# EAGLE design md_ver10.5 (EAGLE 6.4)
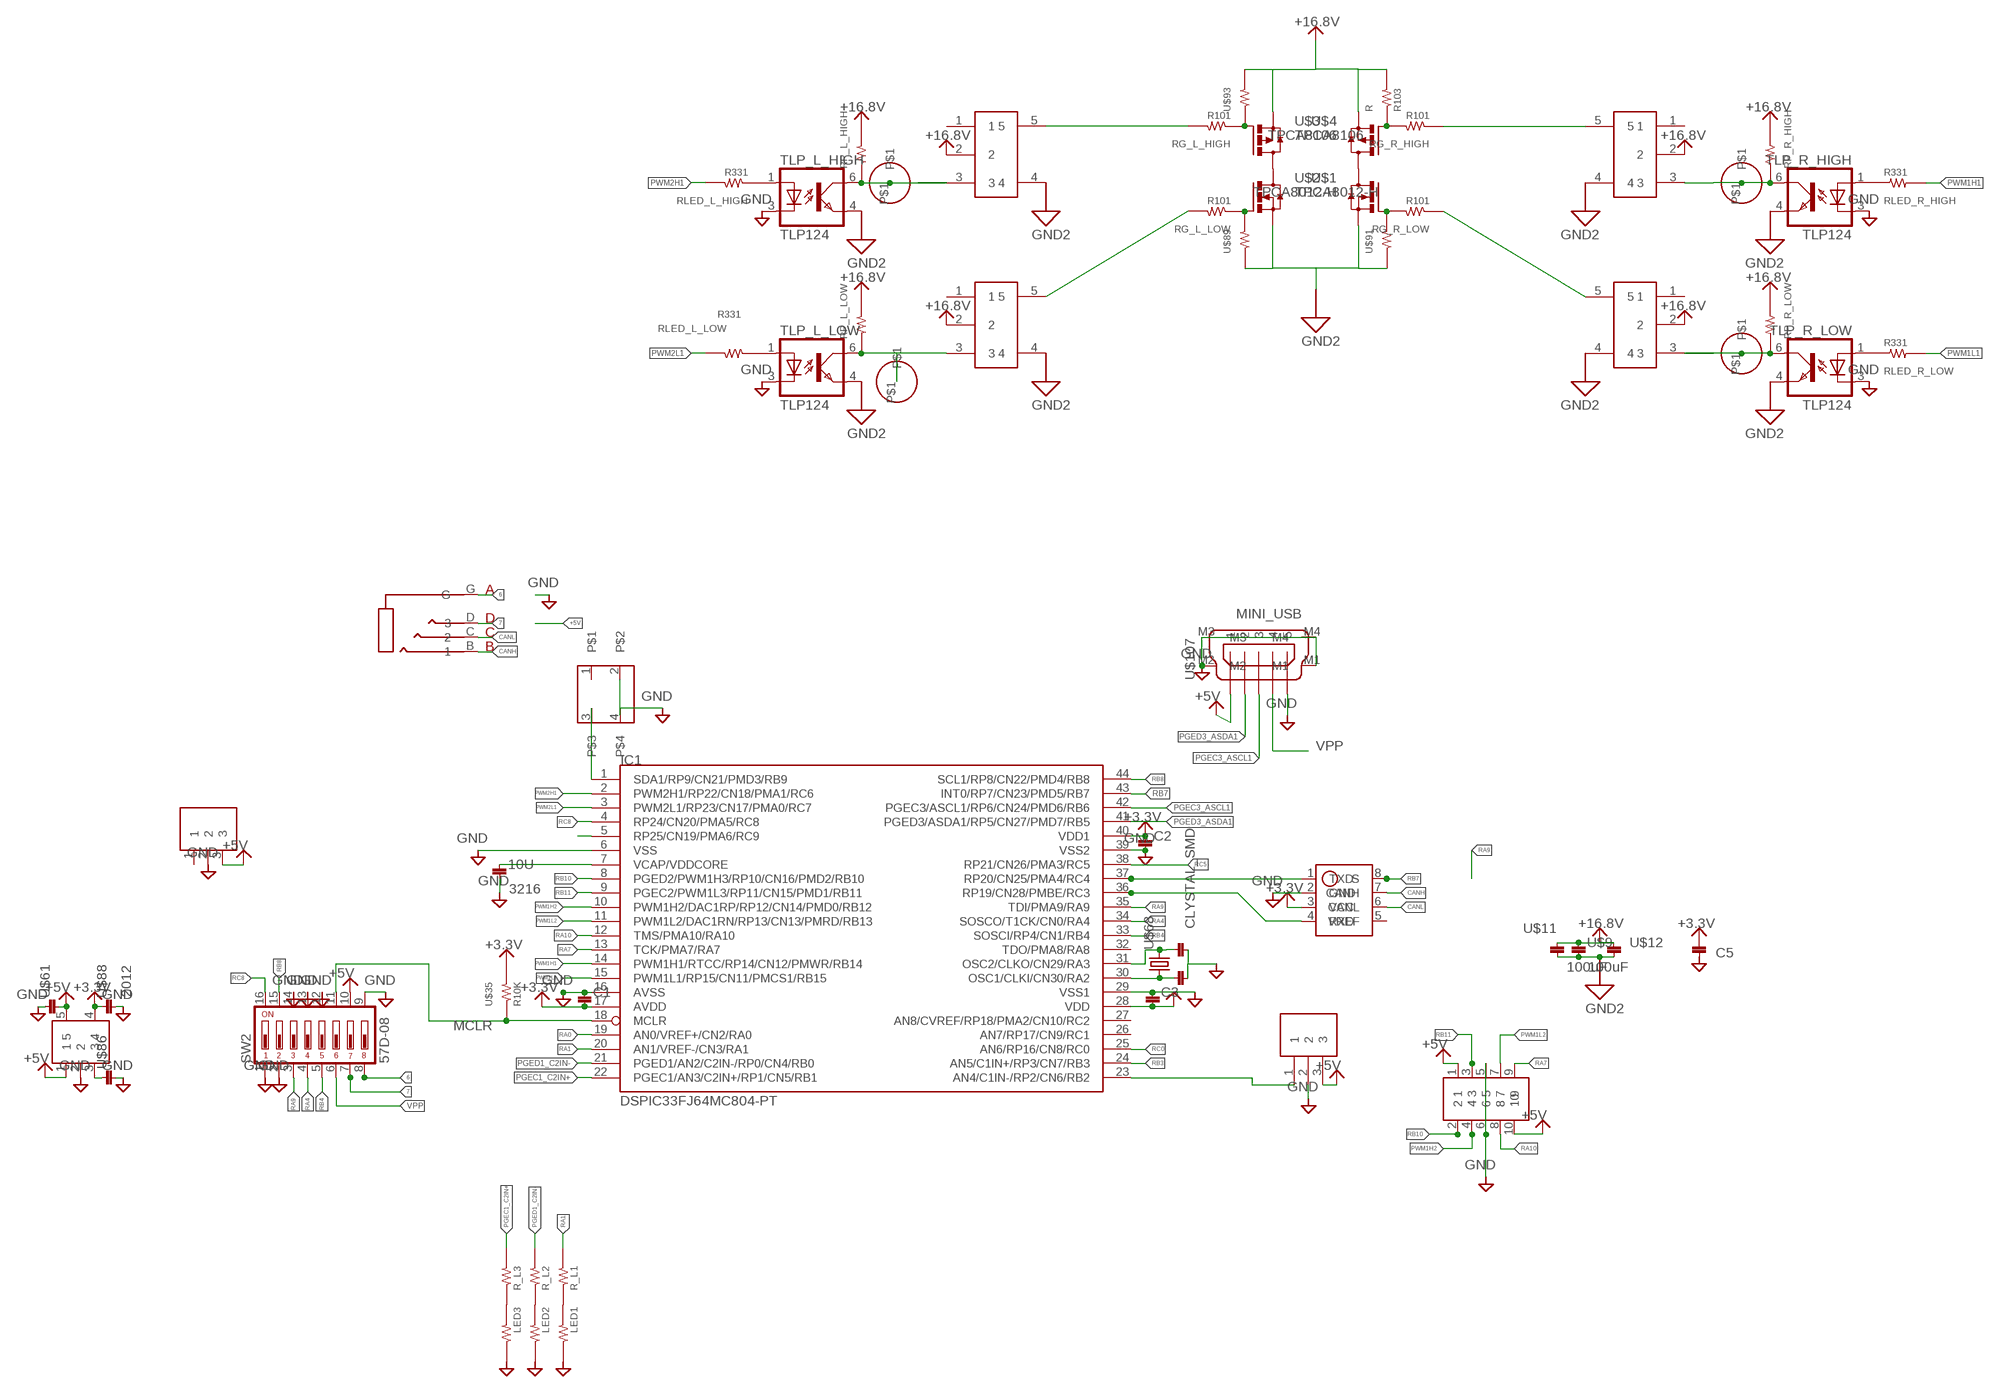
[diagram p0: schematic, sheet 1]

## Parts
10U  3216  [3216]
C  C5  1608  [1608]
C1  1608  [1608]
C2  1608  [1608]
C3  1608  [1608]
IC1  DSPIC33FJ64MC804-PT  [TQFP44]
IC2  TAR5SB  [SSOP5-P-0.95]
IC3  ＰＬ－ＩＲＭ  [ＰＬ－ＩＲＭ]
IC4  SN65HVD1050  [SOIC8]
IC5  Ｒ－７８Ｅ５．０  [Ｒ－７８Ｅ５．０]
IC_L_HIGH  MCP1415  [SOT23-5L]
IC_L_LOW  MCP1415  [SOT23-5L]
IC_R_HIGH  MCP1415  [SOT23-5L]
IC_R_LOW  MCP1415  [SOT23-5L]
R  R103  RESISTOR__SMD  [1608]
RG_L_HIGH  R101  RESISTOR__SMD  [1608]
RG_L_LOW  R101  RESISTOR__SMD  [1608]
RG_R_HIGH  R101  RESISTOR__SMD  [1608]
RG_R_LOW  R101  RESISTOR__SMD  [1608]
RLED_L_HIGH  R331  RESISTOR__SMD  [1608]
RLED_L_LOW  R331  RESISTOR__SMD  [1608]
RLED_R_HIGH  R331  RESISTOR__SMD  [1608]
RLED_R_LOW  R331  RESISTOR__SMD  [1608]
RP_L_HIGH  RESISTOR__SMD  [1608]
RP_L_LOW  RESISTOR__SMD  [1608]
RP_R_HIGH  RESISTOR__SMD  [1608]
RP_R_LOW  RESISTOR__SMD  [1608]
SW1  TACT  [TL1105]
SW2  57D-08  [57D]
TLP_L_HIGH  TLP124  [11−4C1]
TLP_L_LOW  TLP124  [11−4C1]
TLP_R_HIGH  TLP124  [11−4C1]
TLP_R_LOW  TLP124  [11−4C1]
U$1  TPCA8012-H  [2-5Q1A]
U$2  TPCA8012-H  [2-5Q1A]
U$3  TPCA8106  [2-5Q1A]
U$4  TPCA8106  [2-5Q1A]
U$7  20pF  1608  [1608]
U$8  20pF  1608  [1608]
U$9  100uF  3225  [3225]
U$11  100uF  3225  [3225]
U$12  3225  [3225]
U$15  PIN_HEADER_52  [PIN_HEADER_5*2]
U$35  R10K  RESISTOR__SMD  [1608]
U$61  1608  [1608]
U$64  AUDIO4  [AUDIO4_MJ]
U$68  CLYSTAL_SMD  [CRYSTAL_SMD]
U$72  R_L3  RESISTOR__SMD  [1608]
U$74  LED3  RESISTOR__SMD  [1608]
U$75  R_L2  RESISTOR__SMD  [1608]
U$76  LED2  RESISTOR__SMD  [1608]
U$77  R_L1  RESISTOR__SMD  [1608]
U$78  LED1  RESISTOR__SMD  [1608]
U$86  1608  [1608]
U$88  2012  [2012]
U$89  RESISTOR__SMD  [1608]
U$91  RESISTOR__SMD  [1608]
U$93  RESISTOR__SMD  [1608]
U$103  PAD1_4MM  [PAD1_4MM]
U$104  PAD1_4MM  [PAD1_4MM]
U$105  PAD1_4MM  [PAD1_4MM]
U$106  PAD1_4MM  [PAD1_4MM]
U$107  MINI_USB  [MINI_USB]

## Nets
6: SW2.8 U$64.G
7: SW2.7 U$64.D
+3.3V: C1.P$2 C2.P$1 C3.P$2 C.P$1 IC1.17(AVDD) IC1.28(VDD) IC1.40(VDD1) IC2.4 IC4.3(VCC) U$35.2 U$88.1
+5V: IC2.1 IC2.5 IC3.3 IC5.3 SW2.10 U$15.1 U$15.10 U$61.P$2 U$107.1
+16.8V: IC_L_HIGH.2 IC_L_LOW.2 IC_R_HIGH.2 IC_R_LOW.2 R.2 RP_L_HIGH.2 RP_L_LOW.2 RP_R_HIGH.2 RP_R_LOW.2 U$3.1(S) U$3.2(S) U$3.3(S) U$4.1(S) U$4.2(S) U$4.3(S) U$9.P$1 U$11.P$1 U$12.P$1 U$93.2
CANH: IC4.7(CANH) U$64.B
CANL: IC4.6(CANL) U$64.C
GND: 10U.P$2 C1.P$1 C2.P$2 C3.P$1 C.P$2 IC1.6(VSS) IC1.16(AVSS) IC1.29(VSS1) IC1.39(VSS2) IC2.2 IC3.2 IC4.2(GND) IC5.2 SW1.2 SW1.4 SW2.1 SW2.2 SW2.9 SW2.12 SW2.13 SW2.14 TLP_L_HIGH.3(C) TLP_L_LOW.3(C) TLP_R_HIGH.3(C) TLP_R_LOW.3(C) U$7.P$2 U$8.P$2 U$15.5 U$15.6 U$61.P$1 U$74.1 U$76.1 U$78.1 U$86.P$2 U$88.2 U$107.5 U$107.M1 U$107.M2 U$107.M3 U$107.M4
GND2: IC_L_HIGH.4 IC_L_LOW.4 IC_R_HIGH.4 IC_R_LOW.4 TLP_L_HIGH.4(EMIT) TLP_L_LOW.4(EMIT) TLP_R_HIGH.4(EMIT) TLP_R_LOW.4(EMIT) U$1.1(S) U$1.2(S) U$1.3(S) U$2.1(S) U$2.2(S) U$2.3(S) U$9.P$2 U$11.P$2 U$12.P$2 U$89.1 U$91.1
M1: U$2.5(D) U$2.6(D) U$2.7(D) U$2.8(D) U$3.5(D) U$3.6(D) U$3.7(D) U$3.8(D)
M2: U$1.5(D) U$1.6(D) U$1.7(D) U$1.8(D) U$4.5(D) U$4.6(D) U$4.7(D) U$4.8(D)
MCLR: IC1.18(MCLR) SW2.11 U$35.1
N$1: RG_L_LOW.1 U$2.4(G) U$89.2
N$2: IC2.3 U$86.P$1
N$3: RLED_L_LOW.1 TLP_L_LOW.1(A)
N$4: RG_R_LOW.2 U$1.4(G) U$91.2
N$5: IC_L_HIGH.5 RG_L_HIGH.2
N$6: IC_L_LOW.3 RP_L_LOW.1 TLP_L_LOW.6(COL) U$104.P$1
N$7: IC_R_LOW.5 RG_R_LOW.1
N$9: RLED_R_LOW.1 TLP_R_LOW.1(A)
N$11: IC_L_HIGH.3 RP_L_HIGH.1 TLP_L_HIGH.6(COL) U$103.P$1
N$12: RLED_L_HIGH.1 TLP_L_HIGH.1(A)
N$14: IC_L_LOW.5 RG_L_LOW.2
N$15: IC_R_HIGH.3 RP_R_HIGH.1 TLP_R_HIGH.6(COL) U$105.P$1
N$16: RLED_R_HIGH.1 TLP_R_HIGH.1(A)
N$17: IC1.23(AN4/C1IN-/RP2/CN6/RB2) IC3.1
N$18: IC_R_HIGH.5 RG_R_HIGH.1
N$19: RG_L_HIGH.1 U$3.4(G) U$93.1
N$20: R.1 RG_R_HIGH.2 U$4.4(G)
N$21: U$72.1 U$74.2
N$22: IC1.30(OSC1/CLKI/CN30/RA2) U$7.P$1 U$68.1
N$23: IC1.31(OSC2/CLKO/CN29/RA3) U$8.P$1 U$68.2
N$24: U$75.1 U$76.2
N$25: U$77.1 U$78.2
N$26: IC1.1(SDA1/RP9/CN21/PMD3/RB9) SW1.3
N$27: IC1.37(RP20/CN25/PMA4/RC4) IC4.1(TXD)
N$28: IC1.5(RP25/CN19/PMA6/RC9)
N$30: IC1.36(RP19/CN28/PMBE/RC3) IC4.4(RXD)
PGEC1_C2IN+: IC1.22(PGEC1/AN3/C2IN+/RP1/CN5/RB1) U$72.2
PGEC3_ASCL1: IC1.42(PGEC3/ASCL1/RP6/CN24/PMD6/RB6) U$107.3
PGED1_C2IN-: IC1.21(PGED1/AN2/C2IN-/RP0/CN4/RB0) U$75.2
PGED3_ASDA1: IC1.41(PGED3/ASDA1/RP5/CN27/PMD7/RB5) U$107.2
PWM1H1: IC1.14(PWM1H1/RTCC/RP14/CN12/PMWR/RB14) RLED_R_HIGH.2
PWM1H2: IC1.10(PWM1H2/DAC1RP/RP12/CN14/PMD0/RB12) U$15.4
PWM1L1: IC1.15(PWM1L1/RP15/CN11/PMCS1/RB15) RLED_R_LOW.2
PWM1L2: IC1.11(PWM1L2/DAC1RN/RP13/CN13/PMRD/RB13) U$15.7
PWM2H1: IC1.2(PWM2H1/RP22/CN18/PMA1/RC6) RLED_L_HIGH.2
PWM2L1: IC1.3(PWM2L1/RP23/CN17/PMA0/RC7) RLED_L_LOW.2
RA0: IC1.19(AN0/VREF+/CN2/RA0)
RA1: IC1.20(AN1/VREF-/CN3/RA1) U$77.2
RA4: IC1.34(SOSCO/T1CK/CN0/RA4) SW2.4
RA7: IC1.13(TCK/PMA7/RA7) U$15.9
RA9: IC1.35(TDI/PMA9/RA9) SW2.3
RA10: IC1.12(TMS/PMA10/RA10) U$15.8
RB3: IC1.24(AN5/C1IN+/RP3/CN7/RB3)
RB4: IC1.33(SOSCI/RP4/CN1/RB4) SW2.5
RB7: IC1.43(INT0/RP7/CN23/PMD5/RB7) IC4.8(S)
RB8: IC1.44(SCL1/RP8/CN22/PMD4/RB8) SW2.15
RB10: IC1.8(PGED2/PWM1H3/RP10/CN16/PMD2/RB10) U$15.2
RB11: IC1.9(PGEC2/PWM1L3/RP11/CN15/PMD1/RB11) U$15.3
RC0: IC1.25(AN6/RP16/CN8/RC0)
RC5: IC1.38(RP21/CN26/PMA3/RC5)
RC8: IC1.4(RP24/CN20/PMA5/RC8) SW2.16
TLP_R_LOW: IC_R_LOW.3 RP_R_LOW.1 TLP_R_LOW.6(COL) U$106.P$1
VCAP/VDDCORE: 10U.P$1 IC1.7(VCAP/VDDCORE)
VPP: SW2.6 U$107.4
Unconnected: IC1.26(AN7/RP17/CN9/RC1) IC1.27(AN8/CVREF/RP18/PMA2/CN10/RC2) IC1.32(TDO/PMA8/RA8) IC4.5(VREF) IC5.1 IC_L_HIGH.1 IC_L_LOW.1 IC_R_HIGH.1 IC_R_LOW.1 SW1.1

## Library data of the parts
10U = 02_C:3216
C C1-C3 U$7 U$8 U$61 U$86 = 02_C:1608
IC1 = microchip-dspic33fjxxmc:DSPIC33FJ64MC804: dsPIC33FJ32MC302/304, dsPIC33FJ64MCX02/X04, AND dsPIC33FJ128MCX02/X04 High-Performance, 16-bit Digital Signal Controllers Package:44 Pin TQFP Operating Range: * Up to 40 MIPS operation (at 3.0V -3.6V): - Industrial temperature range (-40°C to +85°C) - Extended temperature range (-40°C to +125°C) High-Performance DSC CPU: * Modified Harvard architecture * C compiler optimized instruction set * 16-bit wide data path * 24-bit wide instructions * Linear program memory addressing up to 4M instruction words * Linear data memory addressing up to 64 Kbytes * 83 base instructions: mostly 1 word/1 cycle * Two 40-bit accumulators with rounding and saturation options * Flexible and powerful addressing modes: - Indirect - Modulo - Bit-Reversed * Software stack * 16 x 16 fractional/integer multiply operations * 32/16 and 16/16 divide operations * Single-cycle multiply and accumulate: - Accumulator write back for DSP operations - Dual data fetch * Up to ±16-bit shifts for up to 40-bit data Direct Memory Access (DMA): * 8-channel hardware DMA * Up to 2 Kbytes dual ported DMA buffer area (DMA RAM) to store data transferred via DMA: - Allows data transfer between RAM and a peripheral while CPU is executing code (no cycle stealing) * Most peripherals support DMA Timers/Capture/Compare/PWM: * Timer/Counters, up to five 16-bit timers: - Can pair up to make two 32-bit timers - One timer runs as a Real-Time Clock with an external 32.768 kHz oscillator - Programmable prescaler * Input Capture (up to four channels): - Capture on up, down or both edges - 16-bit capture input functions - 4-deep FIFO on each capture * Output Compare (up to four channels): - Single or Dual 16-bit Compare mode - 16-bit Glitchless PWM mode * Hardware Real-Time Clock/Calendar (RTCC): - Provides clock, calendar, and alarm functions Interrupt Controller: * 5-cycle latency * Up to 53 available interrupt sources * Up to three external interrupts * Seven programmable priority levels * Five processor exceptions Digital I/O: * Peripheral pin Select functionality * Up to 35 programmable digital I/O pins * Wake-up/Interrupt-on-Change for up to 31 pins * Output pins can drive from 3.0V to 3.6V * Up to 5V output with open drain configuration * All digital input pins are 5V tolerant * 4 mA sink on all I/O pins On-Chip Flash and SRAM: * Flash program memory (up to 128 Kbytes) * Data SRAM (up to 16 Kbytes) * Boot, Secure, and General Security for program Flash System Management: * Flexible clock options: - External, crystal, resonator, internal RC - Fully integrated Phase-Locked Loop (PLL) - Extremely low jitter PLL * Power-up Timer * Oscillator Start-up Timer/Stabilizer * Watchdog Timer with its own RC oscillator * Fail-Safe Clock Monitor * Reset by multiple sources Power Management: * On-chip 2.5V voltage regulator * Switch between clock sources in real time * Idle, Sleep, and Doze modes with fast wake-up Analog-to-Digital Converters (ADCs): * 10-bit, 1.1 Msps or 12-bit, 500 Ksps conversion: - Two and four simultaneous samples (10-bit ADC) - Up to nine input channels with auto-scanning - Conversion start can be manual or synchronized with one of four trigger sources - Conversion possible in Sleep mode - ±2 LSb max integral nonlinearity - ±1 LSb max differential nonlinearity Audio Digital-to-Analog Converter (DAC): - 16-bit Dual Channel DAC module - 100 Ksps maximum sampling rate - Second-Order Digital Delta-Sigma Modulator Comparator Module: * Two analog comparators with programmable input/output configuration CMOS Flash Technology: * Low-power, high-speed Flash technology * Fully static design * 3.3V (±10%) operating voltage * Industrial and Extended temperature * Low power consumption Motor Control Peripherals: * 6-channel 16-bit Motor Control PWM: - Three duty cycle generators - Independent or Complementary mode - Programmable dead-time and output polarity - Edge-aligned or center-aligned - Manual output override control - One Fault input - Trigger for ADC conversions - PWM frequency for 16-bit resolution (@ 40 MIPS) = 1220 Hz for Edge-Aligned mode, 610 Hz for Center-Aligned mode - PWM frequency for 11-bit resolution (@ 40 MIPS) = 39.1 kHz for Edge-Aligned mode, 19.55 kHz for Center-Aligned mode * 2-channel 16-bit Motor Control PWM: - One duty cycle generator - Independent or Complementary mode - Programmable dead time and output polarity - Edge-aligned or center-aligned - Manual output override control - One Fault input - Trigger for ADC conversions - PWM frequency for 16-bit resolution (@ 40 MIPS) = 1220 Hz for Edge-Aligned mode, 610 Hz for Center-Aligned mode - PWM frequency for 11-bit resolution (@ 40 MIPS) = 39.1 kHz for Edge-Aligned mode, 19.55 kHz for Center-Aligned mode * 2-Quadrature Encoder Interface module: - Phase A, Phase B, and index pulse input - 16-bit up/down position counter - Count direction status - Position Measurement (x2 and x4) mode - Programmable digital noise filters on inputs - Alternate 16-bit Timer/Counter mode - Interrupt on position counter rollover/underflow
IC2 = 04_IC:TAR5SB
IC3 = 04_IC:ＰＬ－ＩＲＭ
IC4 = 04_IC:SN65HVD1050
IC5 = 04_IC:Ｒ－７８Ｅ５．０
IC_L_HIGH IC_L_LOW IC_R_HIGH IC_R_LOW = 04_IC:MCP1415
R RG_L_HIGH RG_L_LOW RG_R_HIGH RG_R_LOW RLED_L_HIGH RLED_L_LOW RLED_R_HIGH RLED_R_LOW RP_L_HIGH RP_L_LOW RP_R_HIGH RP_R_LOW U$35 U$72 U$74-U$78 U$89 U$91 U$93 = 01_R:RESISTOR__SMD
SW1 = switch:TACT
SW2 = switch:57D-08
TLP_L_HIGH TLP_L_LOW TLP_R_HIGH TLP_R_LOW = 04_IC:TLP124
U$1 U$2 = 06_FET:TPCA8012-H
U$3 U$4 = 06_FET:TPCA8106
U$9 U$11 U$12 = 02_C:3225
U$15 = 08_CONECTOR:PIN_HEADER_5*2
U$64 = 08_CONECTOR:AUDIO4
U$68 = CRYSTAL:CLYSTAL_SMD
U$88 = 02_C:2012
U$103-U$106 = 08_CONECTOR:PAD1_4MM
U$107 = 08_CONECTOR:MINI_USB

## Net classes
0 default: clearance 0.2 mm

## Board
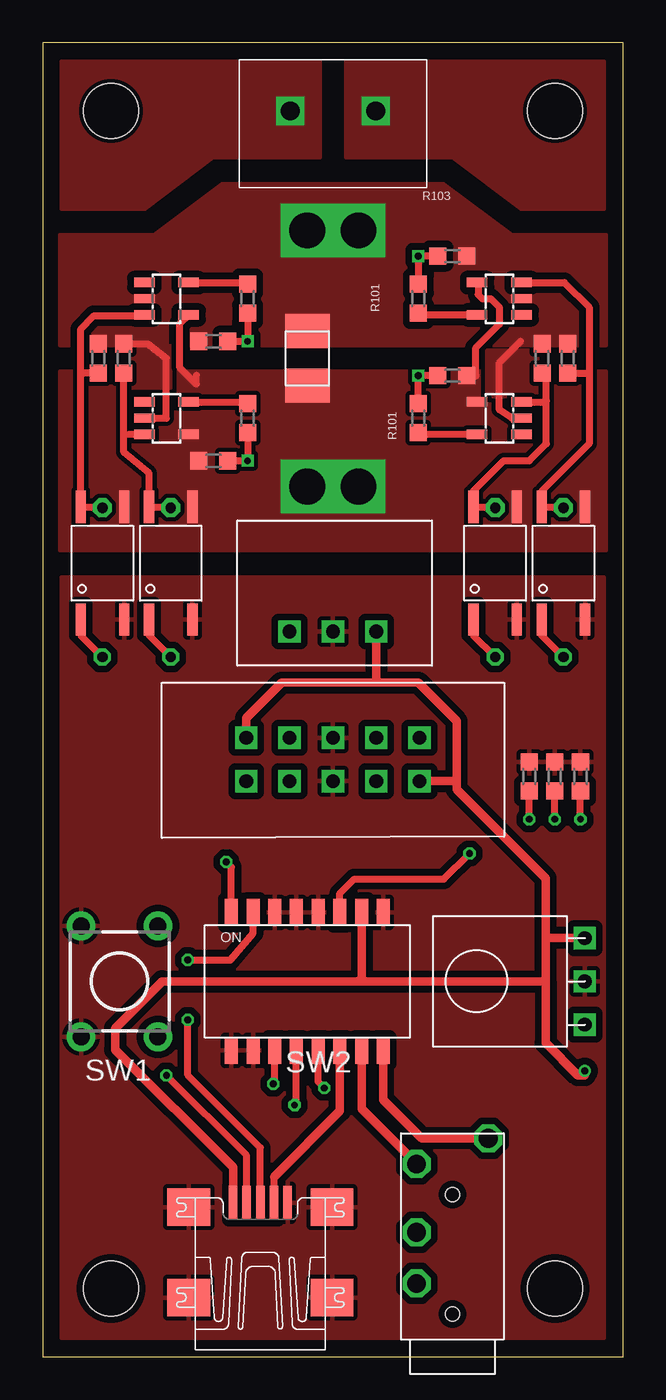
[diagram p1: board, top side]
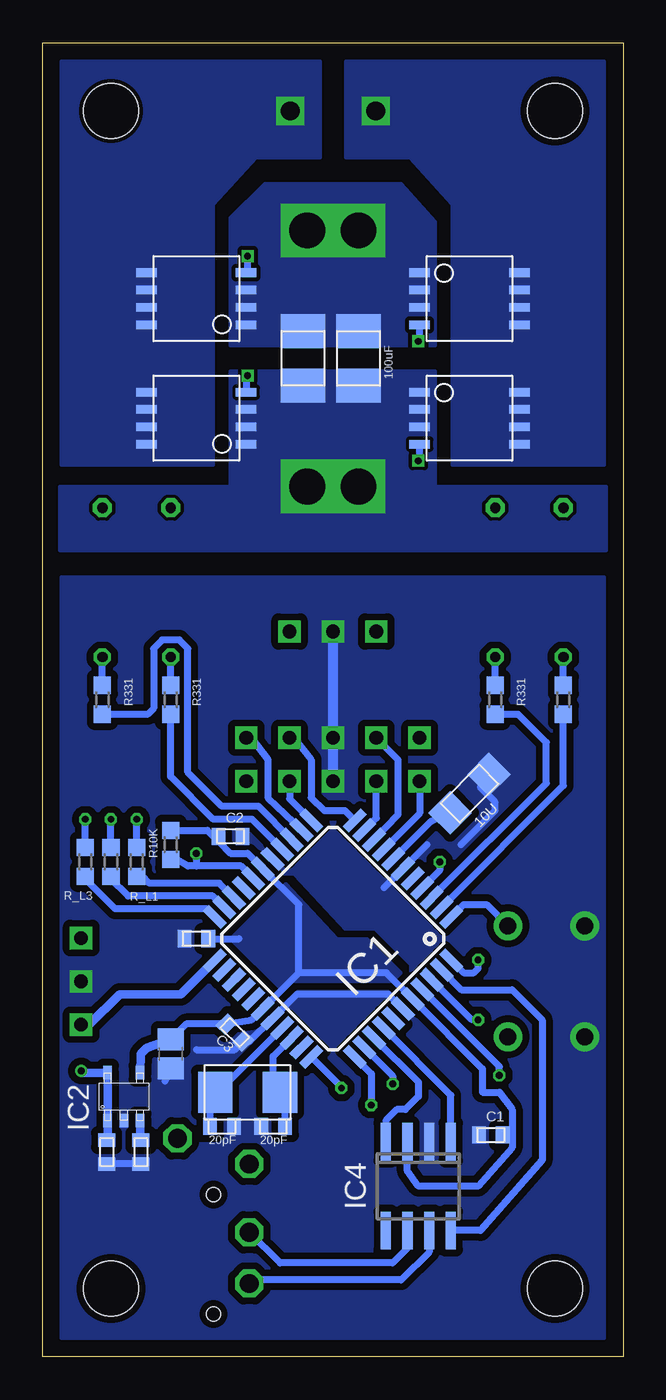
[diagram p2: board, bottom side, seen from below]

Size 34 x 77 mm. Coordinates in mm from the lower left corner, seen from the top.
Outline: 0,0 34,0 34,77 0,77 0,0
Copper layers (1*16): Top 0.035mm / dielectric 1.5mm / Bottom 0.035mm
Design rules "Fusion_eagle_rule_v1.1": minimum track width 6mil, minimum drill 12mil, track to track 6mil, track to pad 6mil, pad to pad 6mil, via to via 6mil, smd to smd 0mil, copper to edge 10mil, drill to drill 10mil, minimum pad ring 10mil, minimum via ring 6mil, stop-mask expansion 2mil, vias tented up to drill 100mil, thermal gap 10mil
Holes 3.2 mm at 4,4 30,4 4,73 30,73

### Footprints (pad centres in the part's own frame; a part is rotated, then mirrored left to right if it is on the bottom)
3216 = smd 1.8 x 1.8: P$1 -1.6,0; P$2 1.6,0
1608 = smd 0.8 x 1: P$1 -0.7,0; P$2 0.7,0
TQFP44 = smd 1.5 x 0.5: 1 -5.8,4; 2 -5.8,3.2; 3 -5.8,2.4; 4 -5.8,1.6; 5 -5.8,0.8; 6 -5.8,0; 7 -5.8,-0.8; 8 -5.8,-1.6; 9 -5.8,-2.4; 10 -5.8,-3.2; 11 -5.8,-4; 23 5.8,-4; 24 5.8,-3.2; 25 5.8,-2.4; 26 5.8,-1.6; 27 5.8,-0.8; 28 5.8,0; 29 5.8,0.8; 30 5.8,1.6; 31 5.8,2.4; 32 5.8,3.2; 33 5.8,4 | smd 0.5 x 1.5: 12 -4,-5.8; 13 -3.2,-5.8; 14 -2.4,-5.8; 15 -1.6,-5.8; 16 -0.8,-5.8; 17 0,-5.8; 18 0.8,-5.8; 19 1.6,-5.8; 20 2.4,-5.8; 21 3.2,-5.8; 22 4,-5.8; 34 4,5.8; 35 3.2,5.8; 36 2.4,5.8; 37 1.6,5.8; 38 0.8,5.8; 39 0,5.8; 40 -0.8,5.8; 41 -1.6,5.8; 42 -2.4,5.8; 43 -3.2,5.8; 44 -4,5.8
SSOP5-P-0.95 = smd 0.5 x 0.8: 1 -0.95,-1.4; 2 0,-1.4; 3 0.95,-1.4; 4 0.95,1.4; 5 -0.95,1.4
ＰＬ－ＩＲＭ = drill 0.8 square: 1 -2.54,0; 2 0,0; 3 2.54,0
SOIC8 = smd 0.6 x 2.2: 1 -1.905,-2.6; 2 -0.635,-2.6; 3 0.635,-2.6; 4 1.905,-2.6; 5 1.905,2.6; 6 0.635,2.6; 7 -0.635,2.6; 8 -1.905,2.6
Ｒ－７８Ｅ５．０ = drill 0.8 square: 1 -2.54,0; 2 0,0; 3 2.54,0
SOT23-5L = smd 0.55 x 1.2: 1 -0.95,-1.3; 2 0,-1.3; 3 0.95,-1.3; 4 0.95,1.3; 5 -0.95,1.3
1608' = smd 1 x 1: 1 -0.85,0; 2 0.85,0
TL1105 = drill 1 pad 1.676: 1 -2.25,3.25; 2 2.25,3.25; 3 -2.25,-3.25; 4 2.25,-3.25
57D = smd 0.76 x 1.58: 1 -4.445,-4.045; 2 -3.175,-4.045; 3 -1.905,-4.045; 4 -0.635,-4.045; 5 0.635,-4.045; 6 1.905,-4.045; 7 3.175,-4.045; 8 4.445,-4.045; 9 4.445,4.045; 10 3.175,4.045; 11 1.905,4.045; 12 0.635,4.045; 13 -0.635,4.045; 14 -1.905,4.045; 15 -3.175,4.045; 16 -4.445,4.045
11−4C1 = smd 0.6 x 1.9: 1 -1.27,-3.3; 3 1.27,-3.3; 4 1.27,3.3; 6 -1.27,3.3
2-5Q1A = smd 0.5 x 1.2: 1 -1.524,-2.921; 2 -0.508,-2.921; 3 0.508,-2.921; 4 1.524,-2.921; 5 1.524,2.921; 6 0.508,2.921; 7 -0.508,2.921; 8 -1.524,2.921
3225 = smd 2 x 2.6: P$1 -1.6,0; P$2 1.6,0
PIN_HEADER_5*2 = drill 0.8 square: 1 -5.08,1.27; 2 -5.08,-1.27; 3 -2.54,1.27; 4 -2.54,-1.27; 5 0,1.27; 6 0,-1.27; 7 2.54,1.27; 8 2.54,-1.27; 9 5.08,1.27; 10 5.08,-1.27
AUDIO4_MJ = drill 1.1 octagon: B 3.3,2.1; C 6.3,2.1; D 10.3,2.1; G 11.8,-2.1 | hole 0.8: 1.5,0; 8.5,0
CRYSTAL_SMD = smd 2 x 2.4: 1 -1.9,0; 2 1.9,0
2012 = smd 1.3 x 1.5: 1 -0.85,0; 2 0.85,0
PAD1_4MM = drill 0.6 pad 1 octagon: P$1 0,0
MINI_USB = smd 2 x 0.5: 1 3.52,1.6; 2 3.52,0.8; 3 3.52,0; 4 3.52,-0.8; 5 3.52,-1.6 | smd 2.2 x 2.5: M1 -2.03,-4.2; M2 -2.03,4.2; M3 3.27,4.2; M4 3.27,-4.2

### Placement (x,y rotation side)
10U  9,33 45 bottom
C  25,24.5 180 bottom
C1  7.75,13 0 bottom
C2  23,30.5 0 bottom
C3  22.75,19 135 bottom
IC1  17,24.5 225 bottom
IC2  29.25,15.25 0 bottom
IC3  31.75,22 90 top
IC4  12,10 180 bottom
IC5  17,42.5 0 top
IC_L_HIGH  7.25,62 270 top
IC_L_LOW  7.25,55 270 top
IC_R_HIGH  26.75,62 90 top
IC_R_LOW  26.75,55 90 top
R  R103  [1608']  24,64.5 0 top
RG_L_HIGH  R101  [1608']  12,62 90 top
RG_L_LOW  R101  [1608']  12,55 90 top
RG_R_HIGH  R101  [1608']  22,62 90 top
RG_R_LOW  R101  [1608']  22,55 90 top
RLED_L_HIGH  R331  [1608']  3.5,38.5 270 bottom
RLED_L_LOW  R331  [1608']  7.5,38.5 270 bottom
RLED_R_HIGH  R331  [1608']  30.5,38.5 270 bottom
RLED_R_LOW  R331  [1608']  26.5,38.5 270 bottom
RP_L_HIGH  [1608']  3.25,58.5 90 top
RP_L_LOW  [1608']  4.75,58.5 90 top
RP_R_HIGH  [1608']  30.75,58.5 90 top
RP_R_LOW  [1608']  29.25,58.5 90 top
SW1  4.5,22 180 top
SW2  15.5,22 0 top
TLP_L_HIGH  3.5,46.5 0 top
TLP_L_LOW  7.5,46.5 0 top
TLP_R_HIGH  30.5,46.5 0 top
TLP_R_LOW  26.5,46.5 0 top
U$1  25,55 90 bottom
U$2  9,55 270 bottom
U$3  9,62 270 bottom
U$4  25,62 90 bottom
U$7  23.5,13.5 0 bottom
U$8  20.5,13.5 180 bottom
U$9  15.5,58.5 270 bottom
U$11  15.5,58.5 270 top
U$12  18.75,58.5 270 bottom
U$15  17,35 0 top
U$35  R10K  [1608']  26.5,30 90 bottom
U$61  30.25,12 90 bottom
U$64  24,1 90 top
U$68  22,15.5 0 bottom
U$72  R_L3  [1608']  31.5,29 270 bottom
U$74  LED3  [1608']  31.5,34 270 top
U$75  R_L2  [1608']  30,29 270 bottom
U$76  LED2  [1608']  30,34 270 top
U$77  R_L1  [1608']  28.5,29 270 bottom
U$78  LED1  [1608']  28.5,34 270 top
U$86  28.25,12 270 bottom
U$88  26.5,17.75 270 bottom
U$89  [1608']  10,52.5 0 top
U$91  [1608']  24,57.5 180 top
U$93  [1608']  10,59.5 180 top
U$103  3.5,49.75 0 top
U$104  7.5,49.75 0 top
U$105  30.5,49.75 0 top
U$106  26.5,49.75 0 top
U$107  12.75,5.5 90 top

### Tracks (layer width: path | path; a pad name or v marks a point on that pad's centre or on a via)
6
  Top 0.5: U$64.G 22.2,12.8 19.95,15.05 SW2.8
7
  Top 0.5: U$64.D 18.68,14.53 SW2.7
+3.3V
  Bottom 0.4: IC1.40 13.87,22.5 19,22.5 | 19,22.5 IC1.28 21.75,19.75 C3.P$2 | 19,22.5 19,26.5 IC1.17 22,29.5 | C2.P$1 23.7,30.2 23,29.5 22,29.5 | 22,29.5 | C.P$1 22.5,24.5
  Bottom 0.406: U$35.2 24.35,30.85 24,30.5 C2.P$1 | C3.P$2 25.61,19.5 U$88.1 | IC1.40 8.25,16.88 8.25,15.5 7.25,15.5 6.5,14.5 6.5,13 | 6.5,13 6.5,12.25 8.5,10 12,10 12.63,10.88 IC4.3 | C1.P$2 6.5,13
  Bottom 0.5: U$88.1 27.9,18.1 28.25,17.75 IC2.4
  pour Bottom: 13.5,22 13,22.5 15,24.5 16.75,24.5 19.75,27.75 23,24.5 20,21.5 19.5,22
+5V  (via drill 0.4)
  Top 0.4: 11.15,10.85 U$107.1
  Top 0.5: 18.5,22 7,22 4.25,19.25 4.25,18 11.15,11.1 U$107.1 | 18.5,22 29.46,22 | SW2.10 18.68,22.18 18.5,22 | 29.46,22 29.46,18.39 31.35,16.5 31.75,16.5 v31.75,16.75 | U$15.1 11.92,37.42 14,39.5 19.5,39.5 | 19.5,39.5 22,39.5 24.25,37.25 24.25,33.75 | IC5.3 19.54,39.54 19.5,39.5 | 29.46,22 29.46,24.54 | 29.46,24.54 29.46,28.04 24.25,33.25 24.25,33.75 | IC3.3 29.46,24.54 | U$15.10 24.23,33.73 24.25,33.75
  Bottom 0.5: U$61.P$2 30.2,12.75 IC2.1 IC2.5 31.65,16.65 v31.75,16.75
+16.8V  (via drill 2.1)
  Top 0.4: IC_L_LOW.2 7.25,55 7.25,58.5 6.15,59.35 RP_L_LOW.2 | IC_R_LOW.2 27.5,55 26.75,55.5 26.75,58.25 28,59.5
  other vias: 18.5,66 15.5,66
  pour Bottom (isolate 0.254, rank 2, no thermals): 13,68.75 21,68.75 23,66.75 23,59.25 11,59.25 11,66.5
  pour Top (isolate 0.406, rank 2, no thermals): 1,59.25 33,59.25 33,65.75 27.5,65.75 23.5,68.75 10.5,68.75 6.5,65.75 1,65.75
  pour Top (isolate 0.25): 5.25,59.25 5.25,56.75 7.5,56.75 7.5,59.25
  pour Top (isolate 0.25): 26,59 26,56.25 29,56.25 29,59
CANH
  Bottom 0.4: IC4.7 11.37,6.13 13,4.5 21.7,4.5 U$64.B
CANL
  Bottom 0.4: IC4.6 12.63,6.37 13.5,5.5 20.1,5.5 U$64.C
GND
  Bottom 0.4: 11.5,30 IC1.6 14,27.5 | 9.5,30 7.5,32 7.5,32.5 8.37,33.37 10U.P$2 | C3.P$1 21.86,18.5 IC1.29 19.12,21.25 13.75,21.25 IC1.39 | U$86.P$2 U$61.P$1
  Bottom 0.406: U$88.2 26.85,16.15 | 25,18 22.76,18 C3.P$1
  Bottom 0.6: IC5.2 U$15.5 U$15.6
  pour Top (isolate 0.4): 1.1,45.7 32.9,45.7 32.9,1.1 1.1,1.1
  pour Bottom (isolate 0.406, rank 2, no thermals): 1.1,45.7 32.9,45.7 32.9,1.1 1.1,1.1
GND2  (via drill 2.1)
  Top 0.4: IC_L_HIGH.4 8,60.5 8,58 9,57 9,57.5 | 25.5,62.9 25.5,62.25 25.75,62 26.25,62 26.75,61.5 26.75,60.5 25.35,59.1 25.35,57.5
  Top 0.5: IC_R_HIGH.4 25.5,62.9 | 25.35,57.5 U$91.1 24.75,57.5
  other vias: 18.5,51 15.5,51
  pour Bottom (isolate 0.1, no thermals): 33,47.25 1,47.25 1,51 11,51 11,57.75 23,57.75 23,51 33,51
  pour Top (isolate 0.25, rank 2, no thermals): 1,57.75 33,57.75 33,47.25 1,47.25
M1  (via drill 1.1)
  other vias: 14.5,73
  pour Bottom (isolate 0.406, no thermals): 1.1,75.9 16.25,75.9 16.25,70.25 12.5,70.25 10,67.5 10,52.25 1.1,52.25
  pour Top (no thermals): 1.1,75.9 16.25,75.9 16.25,70.25 10,70.25 6,67.25 1.1,67.25
M2  (via drill 1.1)
  other vias: 19.5,73
  pour Bottom (isolate 0.254, no thermals): 24,52.25 24,67.5 21.5,70.25 17.75,70.25 17.75,75.9 32.9,75.9 32.9,52.25
  pour Top (no thermals): 17.75,75.9 32.9,75.9 32.9,67.25 28,67.25 24,70.25 17.75,70.25
MCLR  (via drill 0.4)
  Top 0.4: SW2.11 17.41,27.16 18.25,28 23.5,28 v25,29.5
  Bottom 0.4: IC1.18 22.38,28.75 25,28.75 | 25,28.75 25.5,28.75 26.15,29.15 U$35.1 | v25,29.5 25,28.75
N$1  (via drill 0.4)
  Top 0.406: RG_L_LOW.1 v12,52.5 U$89.2
  Bottom 0.406: v12,52.5 11.92,52.58 U$2.4
N$2
  Bottom 0.5: IC2.3 28.3,12.75 U$86.P$1
N$3  (via drill 0.6 pad 1)
  Top 0.406: v7.5,41 6.23,42.27 TLP_L_LOW.1
  Bottom 0.406: RLED_L_LOW.1 v7.5,41
N$4  (via drill 0.4)
  Top 0.406: RG_R_LOW.2 v22,57.5 U$91.2
  Bottom 0.406: v22,57.5 22.08,57.42 U$1.4
N$5
  Top 0.4: IC_L_HIGH.5 11.9,62.95 RG_L_HIGH.2
N$6
  Top 0.4: 4.75,54 4.75,53 6.23,51.77 TLP_L_LOW.6 6.28,49.75 U$104.P$1 | 4.75,54 RP_L_LOW.1 | IC_L_LOW.3 5.05,54.05 4.75,54
N$7
  Top 0.406: IC_R_LOW.5 22,54.05 RG_R_LOW.1
N$9  (via drill 0.6 pad 1)
  Top 0.406: v26.5,41 25.23,42.27 TLP_R_LOW.1
  Bottom 0.406: RLED_R_LOW.1 v26.5,41
N$11
  Top 0.4: 2.23,57.5 TLP_L_HIGH.6 2.28,49.75 U$103.P$1 | 2.23,57.5 2.23,60.23 3,61 6.15,61 IC_L_HIGH.3 | RP_L_HIGH.1 2.38,57.65 2.23,57.5
N$12  (via drill 0.6 pad 1)
  Top 0.406: v3.5,41 2.23,42.27 TLP_L_HIGH.1
  Bottom 0.406: RLED_L_HIGH.1 v3.5,41
N$14
  Top 0.406: IC_L_LOW.5 12,55.95 RG_L_LOW.2
N$15
  Top 0.4: IC_R_HIGH.3 30.55,62.95 32,61.5 32,57.75 | 32,57.75 32,53.5 29.25,50.75 29.25,49.82 TLP_R_HIGH.6 29.28,49.75 U$105.P$1 | RP_R_HIGH.1 31.9,57.65 32,57.75
N$16  (via drill 0.6 pad 1)
  Top 0.406: v30.5,41 29.23,42.27 TLP_R_HIGH.1
  Bottom 0.406: RLED_R_HIGH.1 v30.5,41
N$17
  Bottom 0.5: IC1.23 25.91,21.25 29.5,21.25 31.29,19.46 IC3.1
N$18
  Top 0.406: IC_R_HIGH.5 22.1,61.05 RG_R_HIGH.1
N$19  (via drill 0.4)
  Top 0.406: RG_L_HIGH.1 v12,59.5 U$93.1
  Bottom 0.406: 12,60.48 U$3.4 11.92,59.67 v12,59.5
N$20  (via drill 0.4)
  Top 0.406: RG_R_HIGH.2 v22,64.5 R.1
  Bottom 0.406: U$4.4 22,63.6 v22,64.5
N$21  (via drill 0.4)
  Top 0.406: v31.5,31.5 U$74.2
  Bottom 0.4: U$72.1 v31.5,31.5
N$22
  Bottom 0.4: IC1.30 23.74,15.5 23.74,15 U$68.1 24.2,15.2 U$7.P$1
N$23
  Bottom 0.4: IC1.31 20.5,17.61 20.5,15.9 U$68.2 19.8,15.2 U$8.P$1
N$24  (via drill 0.4)
  Top 0.4: v30,31.5 U$76.2
  Bottom 0.4: U$75.1 v30,31.5
N$25  (via drill 0.4)
  Top 0.4: v28.5,31.5 U$78.2
  Bottom 0.4: U$77.1 v28.5,31.5
N$26
  Bottom 0.4: IC1.1 9.34,26.5 8,26.5 SW1.3
N$27
  Bottom 0.4: IC4.1 10.1,15.33 IC1.37
N$30
  Bottom 0.4: IC1.36 12,16.11 12,15.25 12.75,14.5 13.25,14.5 13.9,13.85 IC4.4
PGEC1_C2IN+
  Bottom 0.4: IC1.22 24.41,26.25 29.75,26.25 31.5,28 U$72.2
PGEC3_ASCL1  (via drill 0.4)
  Top 0.4: U$107.3 12.75,12.25 8.5,16.5 v8.5,19.75
  Bottom 0.4: v8.5,19.75 8.86,19.75 IC1.42
PGED1_C2IN-
  Bottom 0.4: IC1.21 24.02,27 29,27 30,28 U$75.2
PGED3_ASDA1  (via drill 0.4)
  Top 0.4: U$107.2 11.95,11.8 v7.25,16.5
  Bottom 0.4: v7.25,16.5 7.25,17.01 IC1.41
PWM1H1
  Bottom 0.4: IC1.14 21.36,32.25 23.5,32.25 25.5,34.25 25.5,41.5 26,42 27,42 27.5,41.5 27.5,38 27.85,37.65 RLED_R_HIGH.2
PWM1H2
  Bottom 0.4: IC1.10 14.46,31.57 U$15.4
PWM1L1
  Bottom 0.4: IC1.15 21.74,31.5 24,31.5 26.5,34 RLED_R_LOW.2
PWM1L2
  Bottom 0.4: U$15.7 19.27,36.27 18.27,35 18.27,32.75 17.5,32 16.3,32 IC1.11
PWM2H1
  Bottom 0.4: IC1.2 3.5,33.48 RLED_L_HIGH.2
PWM2L1
  Bottom 0.4: IC1.3 4.5,33.61 4.5,36 6.15,37.65 RLED_L_LOW.2
RA1
  Bottom 0.4: IC1.20 23.64,27.75 27.75,27.75 28.15,28.15 U$77.2
RA4  (via drill 0.4)
  Top 0.4: v14.75,14.75 14.87,14.87 SW2.4
  Bottom 0.4: IC1.34 14.75,16.59 v14.75,14.75
RA7
  Bottom 0.4: U$15.9 21.77,36.27 20.81,35 20.81,32.75 IC1.13
RA9  (via drill 0.4)
  Top 0.4: v13.5,16 13.6,16.09 SW2.3
  Bottom 0.4: IC1.35 13.5,16.48 v13.5,16
RA10
  Bottom 0.4: U$15.8 19.54,32.7 IC1.12
RB4  (via drill 0.4)
  Top 0.4: v16.5,15.75 16.13,16.12 SW2.5
  Bottom 0.4: IC1.33 16.7,16 v16.5,15.75
RB7
  Bottom 0.406: IC1.43 9.47,21.5 6.5,21.5 4.75,19.75 4.75,11.5 8.35,7.4 IC4.8
RB8  (via drill 0.4)
  Top 0.4: v8.5,23.25 11,23.25 12.32,24.82 SW2.15
  Bottom 0.4: IC1.44 9.34,22.5 8.75,22.5 8.5,22.75 v8.5,23.25
RB10
  Bottom 0.4: U$15.2 11.92,31.84 IC1.8
RB11
  Bottom 0.4: U$15.3 13.19,35 13.19,31.75 IC1.9
RC8  (via drill 0.4)
  Top 0.4: SW2.16 11.05,28.7 v10.75,29
  Bottom 0.4: v10.75,29 10.75,28.49 IC1.4
TLP_R_LOW
  Top 0.4: 29.5,56 29.5,53.5 28.5,52.5 27,52.5 25.23,50.73 TLP_R_LOW.6 25.28,49.75 U$106.P$1 | 29.5,56 29.5,57.4 RP_R_LOW.1 | IC_R_LOW.3 29.45,55.95 29.5,56
VCAP/VDDCORE
  Bottom 0.4: IC1.7 11.26,31.37 10U.P$1
VPP
  Top 0.4: U$107.4 13.55,10.55
  Top 0.5: 13.55,10.55 17.41,14.4 SW2.6

### Text on the board
_tplace: ON